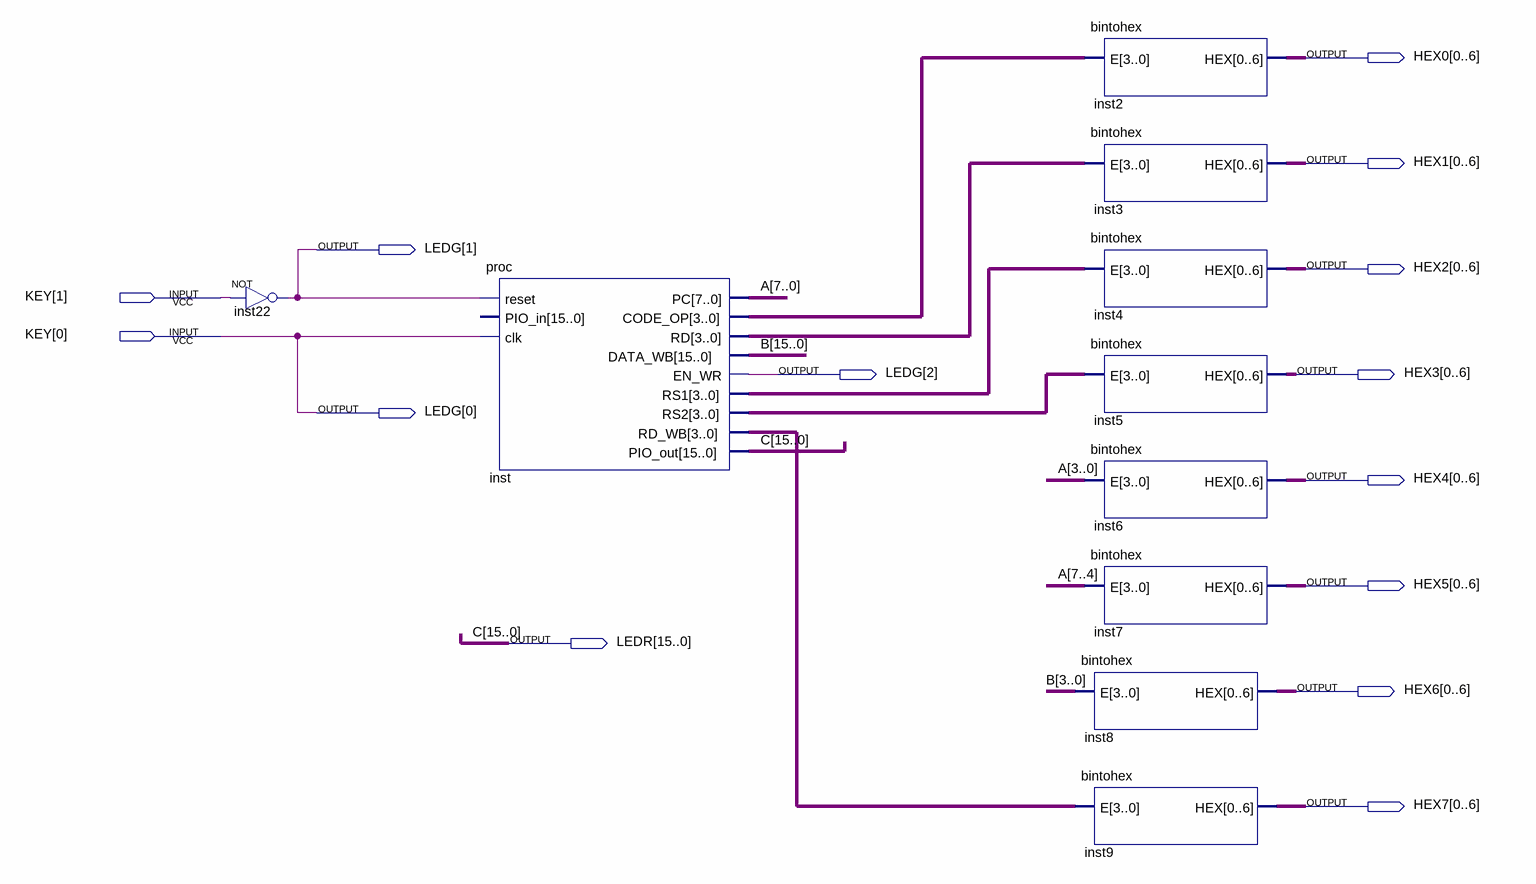
[diagram p0: schematic sheet]
// Quartus schematic test_proc.bdf as structural Verilog: 10 symbols, 14 pins
module test_proc (
  input  [1:0] KEY,
  output [0:6] HEX0,
  output [0:6] HEX1,
  output [2:0] LEDG,
  output [0:6] HEX2,
  output [0:6] HEX3,
  output [0:6] HEX4,
  output [0:6] HEX5,
  output [15:0] LEDR,
  output [0:6] HEX6,
  output [0:6] HEX7
);

  wire [3:0] inst_code_op, inst_rd, inst_rd_wb, inst_rs1, inst_rs2;
  wire [7:0] A;
  wire [15:0] B;

  not inst22 (LEDG[1], KEY[1]);
  proc inst (
    .reset(LEDG[1]), .clk(KEY[0]), .PC(A), .CODE_OP(inst_code_op), .RD(inst_rd), .DATA_WB(B),
    .EN_WR(LEDG[2]), .RS1(inst_rs1), .RS2(inst_rs2), .RD_WB(inst_rd_wb), .PIO_out(LEDR));  // open: PIO_in
  bintohex inst2 (.E(inst_code_op), .HEX(HEX0));
  bintohex inst3 (.E(inst_rd), .HEX(HEX1));
  bintohex inst4 (.E(inst_rs1), .HEX(HEX2));
  bintohex inst5 (.E(inst_rs2), .HEX(HEX3));
  bintohex inst6 (.E(A[3:0]), .HEX(HEX4));
  bintohex inst7 (.E(A[7:4]), .HEX(HEX5));
  bintohex inst8 (.E(B[3:0]), .HEX(HEX6));
  bintohex inst9 (.E(inst_rd_wb), .HEX(HEX7));

  assign LEDG[0] = KEY[0];

  // Other names for the same wires on the sheet: C[15:0] = LEDR
endmodule
